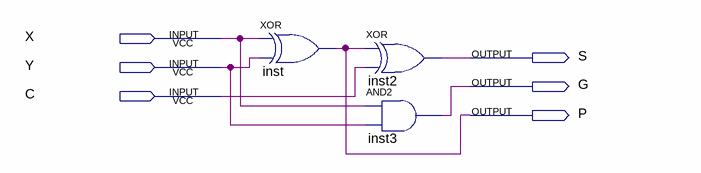
[diagram p0: schematic sheet]
// Quartus schematic partialFullAdder.bdf as structural Verilog: 3 symbols, 6 pins
module partialFullAdder (
  input  X,
  input  Y,
  input  C,
  output S,
  output G,
  output P
);

  xor inst (P, X, Y);
  xor inst2 (S, P, C);
  and inst3 (G, X, Y);
endmodule
